# EAGLE design EnvFollower (EAGLE 7.7.0)
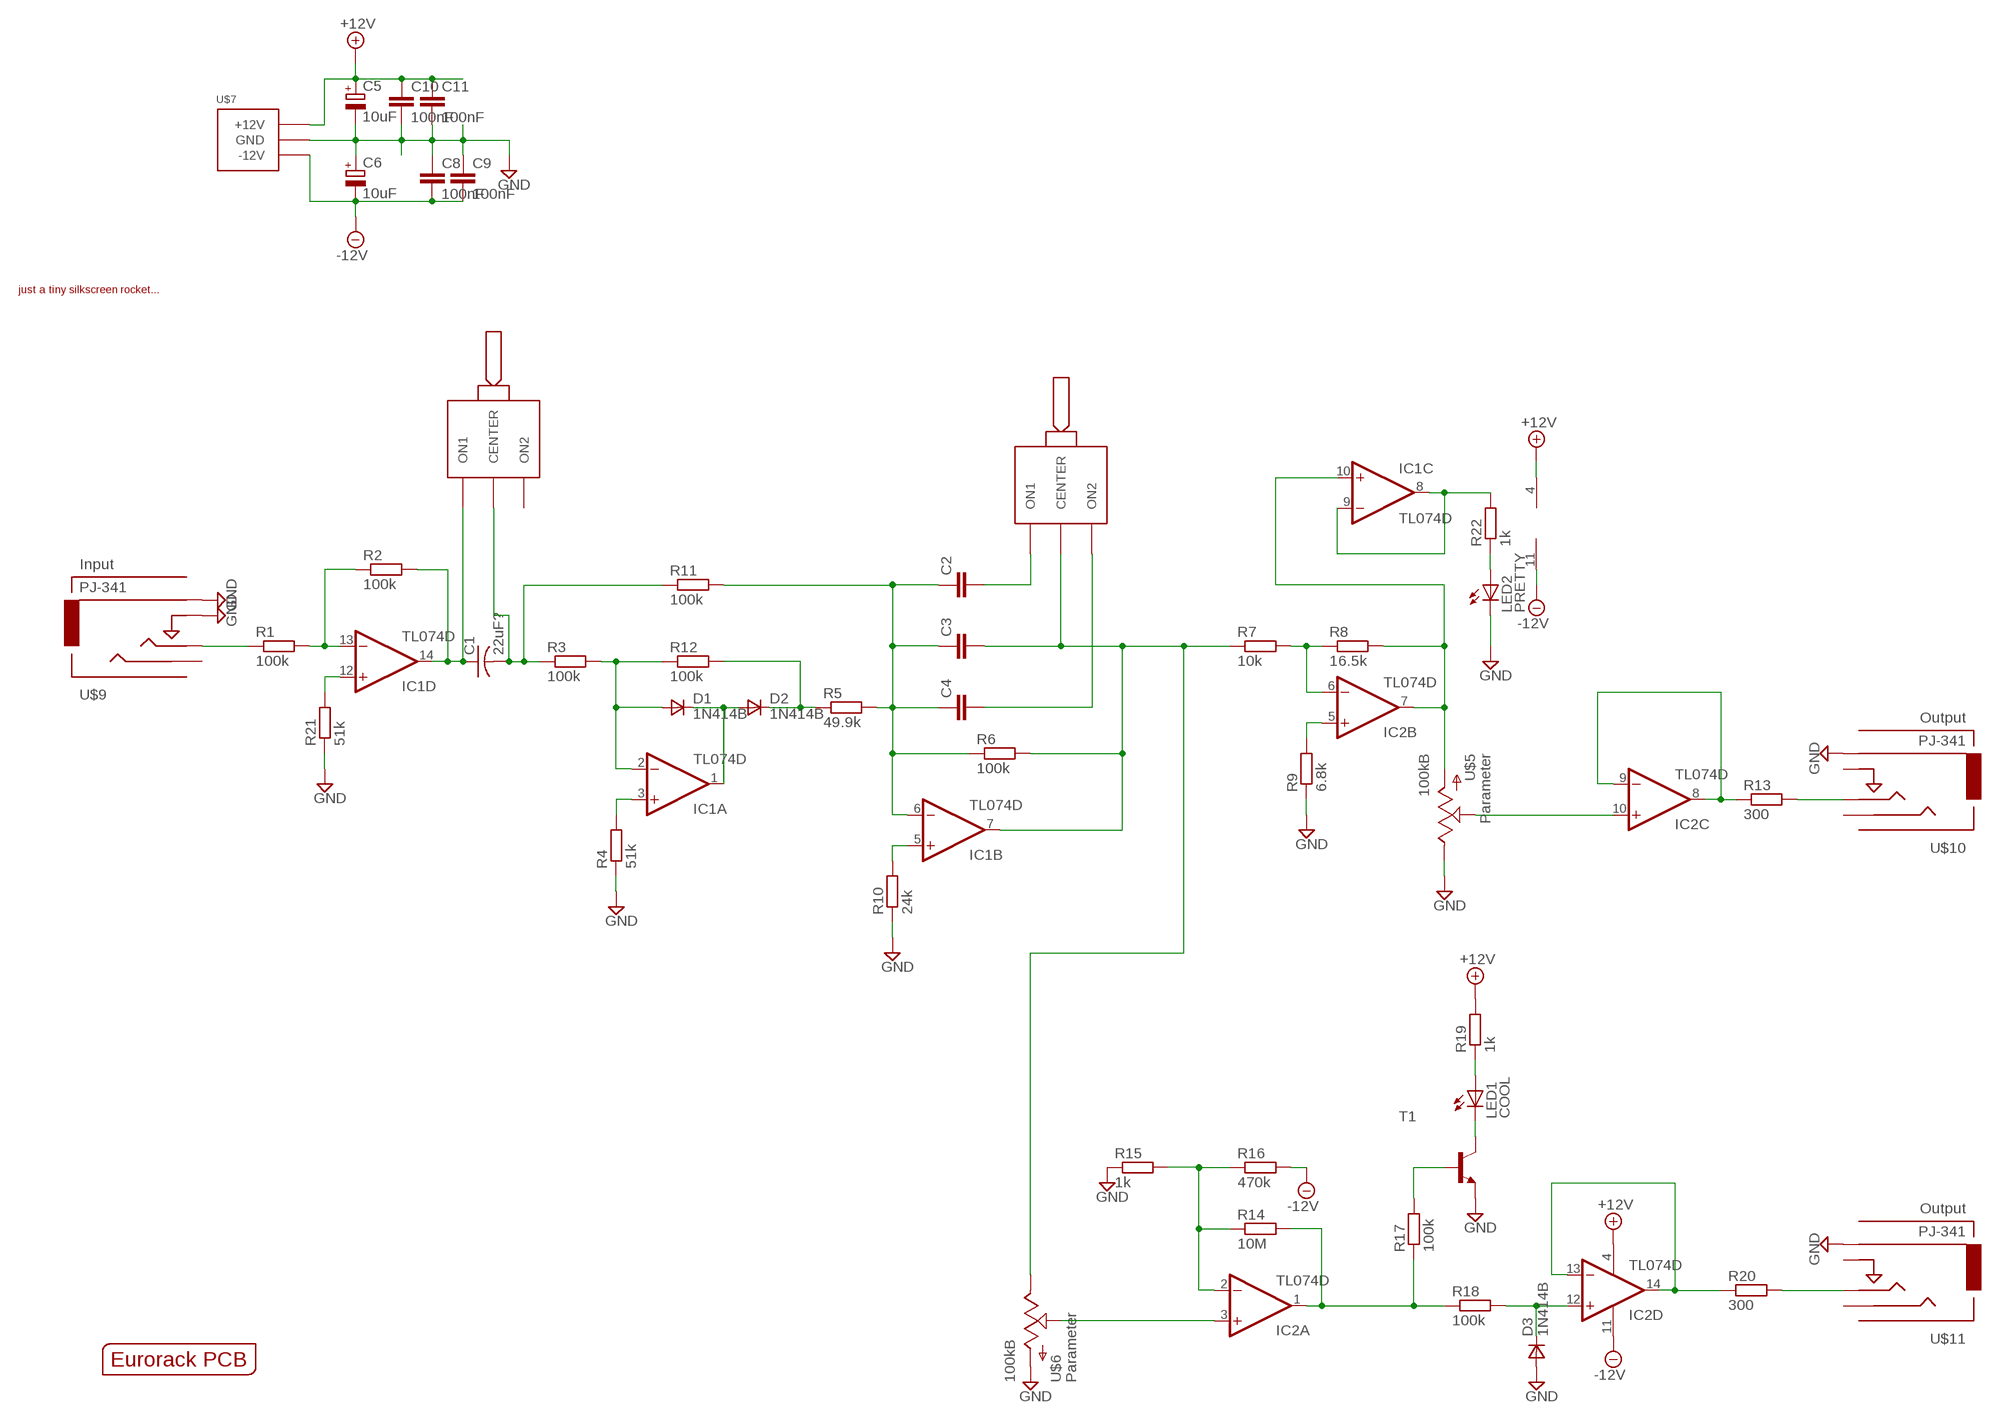
[diagram p0: schematic, sheet 1]

## Parts
C1  22uF?  C-USC1210K  [C1210K]
C2  C-EUC0603K  [C0603K]
C3  C-EUC0603K  [C0603K]
C4  C-EUC0603K  [C0603K]
C5  10uF  CPOL-EU153CLV-0505  [153CLV-0505]
C6  10uF  CPOL-EU153CLV-0505  [153CLV-0505]
C8  100nF  C-EUC0603K  [C0603K]
C9  100nF  C-EUC0603K  [C0603K]
C10  100nF  C-EUC0603K  [C0603K]
C11  100nF  C-EUC0603K  [C0603K]
D1  1N414B  DSOT23  [SOT-23]
D2  1N414B  DSOT23  [SOT-23]
D3  1N414B  DSOT23  [SOT-23]
IC1  TL074D  [SO14]
IC2  TL074D  [SO14]
LED1  COOL  LED3MM  [LED3MM]
LED2  PRETTY  LED3MM  [LED3MM]
R1  100k  R-EU_R0603  [R0603]
R2  100k  R-EU_R0603  [R0603]
R3  100k  R-EU_R0603  [R0603]
R4  51k  R-EU_R0603  [R0603]
R5  49.9k  R-EU_R0603  [R0603]
R6  100k  R-EU_R0603  [R0603]
R7  10k  R-EU_R0603  [R0603]
R8  16.5k  R-EU_R0603  [R0603]
R9  6.8k  R-EU_R0603  [R0603]
R10  24k  R-EU_R0603  [R0603]
R11  100k  R-EU_R0603  [R0603]
R12  100k  R-EU_R0603  [R0603]
R13  300  R-EU_R0603  [R0603]
R14  10M  R-EU_R0603  [R0603]
R15  1k  R-EU_R0603  [R0603]
R16  470k  R-EU_R0603  [R0603]
R17  100k  R-EU_R0603  [R0603]
R18  100k  R-EU_R0603  [R0603]
R19  1k  R-EU_R0603  [R0603]
R20  300  R-EU_R0603  [R0603]
R21  51k  R-EU_R0603  [R0603]
R22  1k  R-EU_R0603  [R0603]
T1  BCX70-NPN-SOT23-BEC  [SOT23-BEC]
U$1  EURORACK_PCB4HP  [EURORACK4HPPCB]
U$2  JUSTATINYROCKET  [JUSTATINYROCKET]
U$4  ONOFFON  [MULTICOMP1MS-ONOFFON]
U$5  100kB  POTZEPHPOT  [OG-POTS_ALPS_POT_VERTICAL]
U$6  100kB  POTZEPHPOT  [OG-POTS_ALPS_POT_VERTICAL]
U$7  POWER_SIMPLE10-OTHERSIDE  [POWER_10_LABELSOTHERSIDE]
U$8  ONOFFON  [MULTICOMP1MS-ONOFFON]
U$9  PJ-341  AUDIO-JACKINPUT  [3.5MM-JACK-SWITCH-13MM-INPUT]
U$10  PJ-341  AUDIO-JACKOUTPUT  [3.5MM-JACK-SWITCH-13MM-OUTPUT]
U$11  PJ-341  AUDIO-JACKOUTPUT  [3.5MM-JACK-SWITCH-13MM-OUTPUT]

## Nets
+12V [power]: C5.+ C10.1 C11.1 IC1.4(P:V+) IC2.4(P:V+) R19.2 U$7.9(+12V) U$7.10(+12V)
-12V [power]: C6.- C8.2 C9.2 IC1.11(P:V-) IC2.11(P:V-) R16.2 U$7.1(-12V) U$7.2(-12V)
GND [power]: C5.- C6.+ C8.1 C9.1 C10.2 C11.2 D3.3(A) LED2.K(C) R4.1 R9.1 R10.1 R15.1 R21.1 T1.E U$5.P$1(E) U$6.P$3(A) U$7.3(GND) U$7.4(GND) U$7.5(GND) U$7.6(GND) U$7.7(GND) U$7.8(GND) U$9.RING@3(RING) U$9.SWITCH@3(SWITCH) U$10.RING@3(RING) U$11.RING@3(RING)
N$1: IC1.8(C:OUT) IC1.9(C:-IN) R22.2
N$2: D2.1(C) R5.1 R12.2
N$3: C2.1 C3.1 C4.1 IC1.6(B:-IN) R5.2 R6.1 R11.2
N$4: R1.1 U$9.TIP@3(TIP)
N$5: IC1.13(D:-IN) R1.2 R2.1
N$6: C1.2 R3.1 R11.1 U$4.2(CENTER)
N$7: C1.1 IC1.14(D:OUT) R2.2 U$4.1(ON1)
N$8 [power]: LED2.A R22.1
N$9: D1.3(A) IC1.2(A:-IN) R3.2 R12.1
N$10: D1.1(C) D2.3(A) IC1.1(A:OUT)
N$11: IC1.3(A:+IN) R4.2
N$12: IC1.12(D:+IN) R21.2
N$15: C3.2 IC1.7(B:OUT) R6.2 R7.1 U$6.P$1(E) U$8.2(CENTER)
N$16: C2.2 U$8.1(ON1)
N$17: C4.2 U$8.3(ON2)
N$20: IC1.5(B:+IN) R10.2
N$22: IC2.6(B:-IN) R7.2 R8.1
N$23: IC2.5(B:+IN) R9.2
N$24: IC1.10(C:+IN) IC2.7(B:OUT) R8.2 U$5.P$3(A)
N$25: IC2.10(C:+IN) U$5.P$2(S)
N$26: IC2.8(C:OUT) IC2.9(C:-IN) R13.1
N$27: R13.2 U$10.TIP@3(TIP)
N$28: IC2.2(A:-IN) R14.1 R15.2 R16.1
N$29: IC2.1(A:OUT) R14.2 R17.1 R18.1
N$30: R17.2 T1.B
N$31: LED1.K(C) T1.C
N$32: LED1.A R19.1
N$33: D3.1(C) IC2.12(D:+IN) R18.2
N$34: IC2.13(D:-IN) IC2.14(D:OUT) R20.1
N$35: R20.2 U$11.TIP@3(TIP)
N$36: IC2.3(A:+IN) U$6.P$2(S)
Unconnected: U$4.3(ON2) U$9.SECOND@3(SECOND) U$10.SECOND@3(SECOND) U$10.SWITCH@3(SWITCH) U$11.SECOND@3(SECOND) U$11.SWITCH@3(SWITCH)

## Library data of the parts
C1 = adafruit:C-US: CAPACITOR, American symbol
C2-C4 C8-C11 = resistor:C-EU: CAPACITOR, European symbol
C5 C6 = resistor:CPOL-EU: POLARIZED CAPACITOR, European symbol
D1-D3 = zetex:D: DIODE; MPN: CDSOT23-T03; OC_FARNELL: 1824866; OC_NEWARK: 75K7096
IC1 IC2 = EurorackModularParts:TL074: OP AMP
LED1 LED2 = led:LED: LED OSRAM: - CHIPLED LG R971, LG N971, LY N971, LG Q971, LY Q971, LO R971, LY R971 LH N974, LH R974 LS Q976, LO Q976, LY Q976 LO Q996 - Hyper CHIPLED LW Q18S LB Q993, LB Q99A, LB R99A - SideLED LS A670, LO A670, LY A670, LG A670, LP A670 LB A673, LV A673, LT A673, LW A673 LH A674 LY A675 LS A676, LA A676, LO A676, LY A676, LW A676 LS A679, LY A679, LG A679 - Hyper Micro SIDELED® LS Y876, LA Y876, LO Y876, LY Y876 LT Y87S - SmartLED LW L88C, LW L88S LB L89C, LB L89S, LG L890 LS L89K, LO L89K, LY L89K LS L896, LA L896, LO L896, LY L896 - TOPLED LS T670, LO T670, LY T670, LG T670, LP T670 LSG T670, LSP T670, LSY T670, LOP T670, LYG T670 LG T671, LOG T671, LSG T671 LB T673, LV T673, LT T673, LW T673 LH T674 LS T676, LA T676, LO T676, LY T676, LB T676, LH T676, LSB T676, LW T676 LB T67C, LV T67C, LT T67C, LS T67K, LO T67K, LY T67K, LW E67C LS E67B, LA E67B, LO E67B, LY E67B, LB E67C, LV E67C, LT E67C LW T67C LS T679, LY T679, LG T679 LS T770, LO T770, LY T770, LG T770, LP T770 LB T773, LV T773, LT T773, LW T773 LH T774 LS E675, LA E675, LY E675, LS T675 LS T776, LA T776, LO T776, LY T776, LB T776 LHGB T686 LT T68C, LB T68C - Hyper Mini TOPLED® LB M676 - Mini TOPLED Santana® LG M470 LS M47K, LO M47K, LY M47K Source: http://www.osram.convergy.de LUXEON: - LUMILED® LXK2-PW12-R00, LXK2-PW12-S00, LXK2-PW14-U00, LXK2-PW14-V00 LXK2-PM12-R00, LXK2-PM12-S00, LXK2-PM14-U00 LXK2-PE12-Q00, LXK2-PE12-R00, LXK2-PE12-S00, LXK2-PE14-T00, LXK2-PE14-U00 LXK2-PB12-K00, LXK2-PB12-L00, LXK2-PB12-M00, LXK2-PB14-N00, LXK2-PB14-P00, LXK2-PB14-Q00 LXK2-PR12-L00, LXK2-PR12-M00, LXK2-PR14-Q00, LXK2-PR14-R00 LXK2-PD12-Q00, LXK2-PD12-R00, LXK2-PD12-S00 LXK2-PH12-R00, LXK2-PH12-S00 LXK2-PL12-P00, LXK2-PL12-Q00, LXK2-PL12-R00 Source: www.luxeon.com KINGBRIGHT: KA-3528ASYC Source: www.kingbright.com
R1-R22 = resistor:R-EU_: RESISTOR, European symbol
T1 = transistor:*-NPN-: NPN Transistror BF959 corrected 2008.03.06
U$1 = EurorackModularParts:EURORACK_PCB
U$2 = zephod-components:JUSTATINYROCKET
U$4 U$8 = EurorackModularParts:ONOFFON
U$5 U$6 = EurorackModularParts:POT; DESC: Parameter
U$7 = EurorackModularParts:POWER_SIMPLE
U$9 = EurorackModularParts:AUDIO-JACK: Switching Mono 3.5mm Audio Jack from Erthenvar.; DESC: Input; MPN: PJ-341
U$10 U$11 = EurorackModularParts:AUDIO-JACK: Switching Mono 3.5mm Audio Jack from Erthenvar.; DESC: Output; MPN: PJ-341

## Net classes
0 default: width 0.203 mm
1 power: width 0.381 mm

## Board
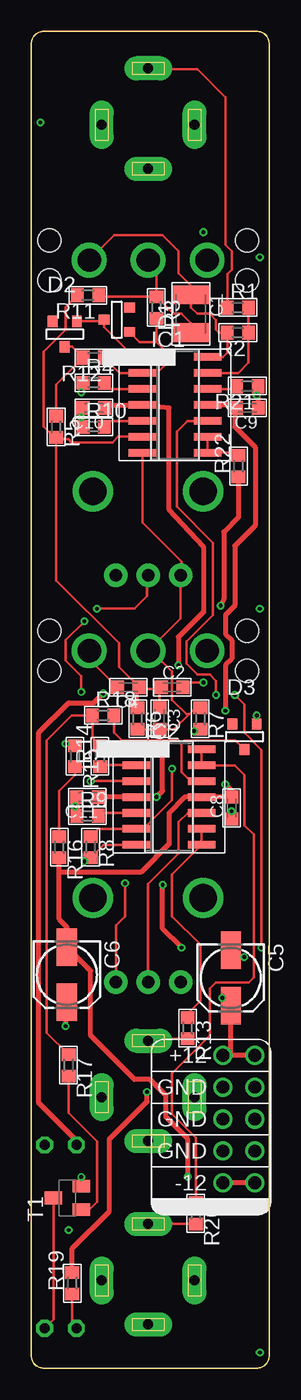
[diagram p1: board, top side]
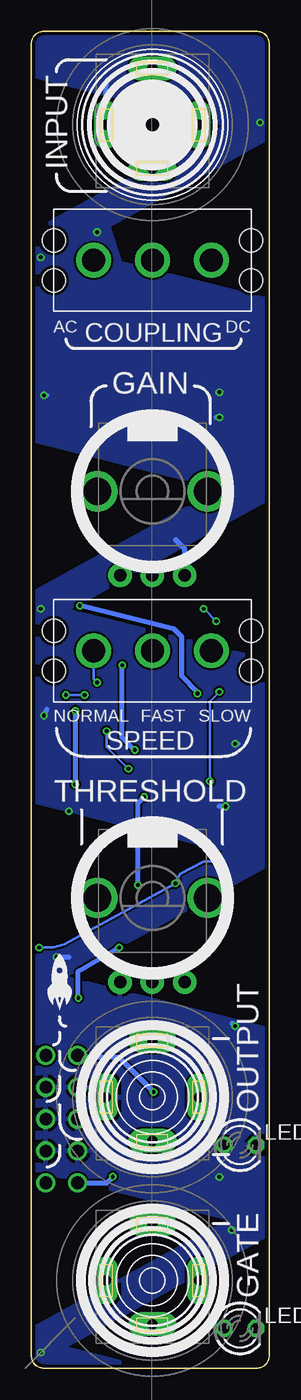
[diagram p2: board, bottom side, seen from below]

Size 18.98 x 106.5 mm. Coordinates in mm from the lower left corner, seen from the top.
Copper layers (1*16): Top 0.035mm / dielectric 1.5mm / Bottom 0.035mm
Design rules "ITEADstudio_DRC": minimum track width 6mil, minimum drill 12mil, track to track 6mil, track to pad 6mil, pad to pad 6mil, via to via 6mil, smd to smd 0mil, copper to edge 10mil, drill to drill 10mil, minimum pad ring 10mil, minimum via ring 6mil, stop-mask expansion 2mil, vias tented up to drill 100mil, thermal gap 10mil

### Footprints (pad centres in the part's own frame; a part is rotated, then mirrored left to right if it is on the bottom)
C1210K = smd 1.5 x 2.9: 1 -1.5,0; 2 1.5,0
C0603K = smd 1.05 x 1.08: 1 -0.875,0; 2 0.875,0
153CLV-0505 = smd 3 x 1.6: + 2.2,0; - -2.2,0
SOT-23 = smd 0.787 x 0.889: 1 0.025,-1.016; 2 -0.94,1.016; 3 0.991,1.016
SO14 = smd 0.6 x 2.2: 1 -3.81,-2.6; 2 -2.54,-2.6; 3 -1.27,-2.6; 4 0,-2.6; 5 1.27,-2.6; 6 2.54,-2.6; 7 3.81,-2.6; 8 3.81,2.6; 9 2.54,2.6; 10 1.27,2.6; 11 0,2.6; 12 -1.27,2.6; 13 -2.54,2.6; 14 -3.81,2.6
LED3MM = drill 0.813 octagon: A -1.27,0; K 1.27,0
R0603 = smd 1 x 1.1: 1 -0.85,0; 2 0.85,0
SOT23-BEC = smd 1 x 1.4: B -0.95,-1.1; C 0,1.1; E 0.95,-1.1
MULTICOMP1MS-ONOFFON = drill 1.85: 1 -4.7,0; 2 0,0; 3 4.7,0 | hole 1.85: -7.875,1.59; -7.875,-1.59; 7.875,1.59; 7.875,-1.59
OG-POTS_ALPS_POT_VERTICAL = drill 1 pad 1.88: P$1 -2.58,-6.7; P$2 0,-6.7; P$3 2.58,-6.7 | drill 2.2 pad 3.175: P$4 4.4,0; P$5 -4.4,0
POWER_10_LABELSOTHERSIDE = drill 1.016: 1 -5.08,-1.27; 2 -5.08,1.27; 3 -2.54,-1.27; 4 -2.54,1.27; 5 0,-1.27; 6 0,1.27; 7 2.54,-1.27; 8 2.54,1.27; 9 5.08,-1.27; 10 5.08,1.27
3.5MM-JACK-SWITCH-13MM-INPUT = drill 0.8 pad 1.93 long: RING@3 -3.7,0; SECOND@3 0,-3.5; SWITCH@3 3.7,0; TIP@3 0,4.5
3.5MM-JACK-SWITCH-13MM-OUTPUT = drill 0.8 pad 1.93 long: RING@3 -3.7,0; SECOND@3 0,-3.5; SWITCH@3 3.7,0; TIP@3 0,4.5

### Placement (x,y rotation side)
C1  12.73,84 270 top
C2  11.23,54.25 0 top
C3  10.23,51.75 270 top
C4  7.73,54.25 180 top
C5  15.91,31.09 270 top
C6  2.84,31.34 270 top
C8  15.98,44.62 90 top
C9  17.23,76.5 180 top
C10  4.98,76.5 180 top
C11  4.48,45.5 180 top
D1  6.82,83.55 270 top
D2  2.64,82.38 0 top
D3  16.98,50.3 0 top
IC1  11.46,76.74 270 top
IC2  10.98,45.5 270 top
LED1  2.34,3.17 0 bottom
LED2  2.34,17.78 0 bottom
R1  16.48,84.5 0 top
R2  16.48,82.5 180 top
R3  9.98,84.5 270 top
R4  4.98,78.5 0 top
R5  1.98,75 270 top
R6  8.48,51.75 270 top
R7  13.48,51.75 270 top
R8  4.73,41.5 270 top
R9  4.48,44 0 top
R10  4.98,75 0 top
R11  4.52,85.48 180 top
R12  4.98,80.5 180 top
R13  12.47,27.09 270 top
R14  5.48,48.75 90 top
R15  3.48,48.75 270 top
R16  2.23,41.5 270 top
R17  2.97,24.13 270 top
R18  5.73,52 0 top
R19  3.26,6.77 90 top
R20  13.12,12.34 270 top
R21  17.23,78.25 180 top
R22  16.52,71.87 90 top
T1  2.88,13.57 90 top
U$1  19.48,0 0 bottom
U$2  16.73,30.75 0 bottom
U$4  9.32,88.27 180 bottom
U$5  9.32,37.47 0 bottom
U$6  9.32,69.85 0 bottom
U$7  16.55,19.84 90 top
U$8  9.32,57.15 0 bottom
U$9  9.32,99.06 0 bottom
U$10  9.32,21.59 0 bottom
U$11  9.32,6.98 0 bottom

### Tracks (layer width: path | path; a pad name or v marks a point on that pad's centre or on a via)
+12V  (via drill 0.3)
  Top 0.381: U$7.9 U$7.10 15.91,24.92 C5.+ 15.84,28.89 v15.23,29.5 | C11.1 IC2.4 v9.98,45.5 10.48,46 10.48,49 v10.73,49.25 | C10.1 6.1,76.74 IC1.4 8.99,76.63 9.61,76.63 11,76.5 11,68.41 13.76,65.4 13.76,60.28 11.73,58.25 v11.73,56 | R19.2 3.26,9.53 6.23,12.5 6.23,18.25 9.23,21.25 v9.23,22 | v11.98,33.5 10.48,35 v10.48,38.5
  Bottom 0.381: v9.23,22 11.98,24.75 14.87,24.75 U$7.10 | v15.23,29.5 15.23,31.62 v11.98,33.5 | v10.48,38.5 10.48,45 v9.98,45.5 | v10.73,49.25 11.75,50.27 11.75,55.98 v11.73,56
-12V  (via drill 0.3)
  Top 0.381: U$7.1 U$7.2 | IC1.11 16.3,76.74 C9.2 16.23,76.38 16.23,75 17.86,73.38 17.86,67.12 16.23,65.5 16.23,60.75 15.48,60 15.48,58.5 15.98,58 15.98,56.5 15.48,56 v15.48,52.38 | 2.23,39.5 2.23,35.75 2.84,35.14 C6.- 4.73,31.65 4.73,26.5 8.23,23 9.48,23 10.73,21.75 10.73,20 12.48,18.25 v12.48,15.25 | 2.23,39.5 R16.2 | 2.23,39.5 8.73,39.5 10.98,41.75 10.98,44.25 12.23,45.5 IC2.11 C8.2 16.11,45.88 v15.48,46.5
  Bottom 0.381: U$7.2 12.97,14.76 v12.48,15.25 | v15.48,52.38 v15.48,46.5
GND  (via drill 0.3)
  Top 0.381: T1.E v3.97,15.23 v3.98,15.23 | C5.- 15.91,32.83 v16.98,32.75 | C6.+ 2.73,27.5 v2.73,27.25 | C8.1 v15.98,44.38 | D3.3 17.99,51.51 v17.98,52 | R15.1 v2.73,49.75 | C11.2 3.61,44.88 v3.48,44.75 3.63,44.6 R9.1 | R10.1 3.98,75.15 v3.98,75.75 3.98,76.38 C10.2 | R4.1 4.23,78.4 v3.98,77.75 | R21.1 18.08,77.6 v17.98,77.5 18.11,77.38 C9.1
  Bottom 0.381: v3.98,15.23 3.98,15.09 | v16.98,32.75 15.98,32.75 | v2.73,27.25 2.98,27.5 | v15.98,44.38 15.98,44.5 | v17.98,52 17.73,52.5 | v2.73,49.75 2.48,49.75 | v3.48,44.75 3.98,44.75 | v3.98,75.75 4.23,75.75 | v17.98,77.5 17.73,77.5 | U$6.P$3 6.74,65.26 7.48,66 | U$9.RING@3 13.02,102.21 12.98,102.25
  other vias: 18.23,1.25 2.98,11 18.23,60.5 18.23,88.5 0.73,99.25 13.73,90.5
  pour Bottom: -0.77,26.75 19.98,32 20.23,16.25 -0.52,11
  pour Bottom: -1.02,56 19.73,61.25 19.98,45.5 -0.77,40.25
  pour Bottom: -1.02,84.75 19.73,90 19.98,74.25 -0.77,69
  pour Bottom: -1.27,113.75 19.48,119 19.73,103.25 -1.02,98
  pour Bottom: -0.77,-2.75 19.98,2.5 20.23,-13.25 -0.52,-18.5
  pour Bottom: -0.52,13.75 19.98,2.5 19.98,-0.25 -0.52,11
  pour Bottom: -0.52,43.25 19.98,32 19.98,29.25 -0.52,40.5
  pour Bottom: -0.77,72.5 19.73,61.25 19.73,58.5 -0.77,69.75
  pour Bottom: -0.77,101.25 19.73,90 19.73,87.25 -0.77,98.5
  pour Bottom: 15.73,91 15.73,90.75 12.98,91.25 11.73,87.5 16.48,86.5 16.48,91
N$1
  Top 0.203: IC1.9 IC1.8 16.31,72.93 R22.2
N$2
  Top 0.203: R5.1 1.98,78.35 R12.2 3.27,81.36 D2.1
N$3
  Top 0.203: R5.2 1.83,74.15 0.98,75 0.98,81 2.73,82.75 2.73,84.54 R11.2 | IC1.6 6.93,74.2 6.48,73.75 3.23,73.75 2.98,74 2.13,74 R5.2 | C3.1 10.23,54.12 | 10.23,54.12 C2.1 | R6.1 8.48,54.12 C4.1 | 10.23,54.12 8.73,54.12 C4.1 | C4.1 6.98,55.88 6.98,57.75 1.98,62.75 R5.2
N$4
  Top 0.203: U$9.TIP@3 9.38,103.5 13.23,103.5 15.48,101.25 15.48,89.5 15.98,89 15.98,87.5 15.63,87.15 R1.1
N$5
  Top 0.203: IC1.13 16.51,79.28 17.33,80.1 R2.1 R1.2
N$6
  Top 0.203: 10.01,85.38 R3.1 | R3.1 5.5,85.35 R11.1 | R3.1 9.98,87.6 U$4.2 | C1.2 12.73,83.25 11.98,84 11.33,84 R3.1
N$7
  Top 0.203: U$4.1 6.61,90.25 10.48,90.25 11.73,89 11.73,87.25 12.73,86.25 C1.1 12.73,84.5 13.23,84 14.23,84 14.73,83.5 14.73,82.75 14.98,82.5 R2.2 15.63,80.9 15.28,80.55 IC1.14
N$8  (via drill 0.3)
  Top 0.381: R22.1 16.52,67.79 15.36,66.62 15.36,61.25 v15.11,60.75 | LED2.A 3.61,18.12 0.61,21.12 0.61,50.62 2.98,53 4.98,53 v5.73,53.75
  Bottom 0.381: v5.73,53.75 5.73,53.88 6.98,55.12 6.98,58.25 7.61,58.88 v15.11,60.75
N$9
  Top 0.203: R12.1 7.05,79.28 IC1.2 10.01,79.28 10.73,80 10.73,81 9.98,81.75 | 9.98,81.75 R3.2 | 9.98,81.75 8.64,81.75 D1.3
N$10
  Top 0.203: D2.3 5.67,83.4 D1.1 5.8,82.93 8.23,80.5 8.8,80.5 IC1.1
N$11
  Top 0.203: R4.2 6.32,78.01 IC1.3
N$12
  Top 0.203: R21.2 16.02,78.01 IC1.12
N$15
  Top 0.203: IC1.7 8.86,67.38 11.98,64.25 11.98,63.23 U$6.P$1 11.9,59.73 U$8.2 9.58,57.15 11.23,55.5 11.23,53.25 12.36,52.12 12.61,52.12 | R7.1 13.08,52.6 12.61,52.12 | 12.61,52.12 11.36,50.88 C3.2 8.51,50.88 R6.2
N$16  (via drill 0.3)
  Top 0.203: v13.73,54.62 12.48,54.62 C2.2
  Bottom 0.203: U$8.1 14.02,54.91 v13.73,54.62
N$17
  Top 0.203: C4.2 4.62,56.48 U$8.3
N$20
  Top 0.203: IC1.5 6.3,75.47 R10.2
N$22  (via drill 0.3)
  Top 0.203: R8.1 5.34,42.96 IC2.6 8.46,43.03 8.99,43.03 11.23,45.27 v11.23,47.75 | R7.2 13.33,50.75 v12.98,50.75
  Bottom 0.203: v11.23,47.75 12.98,49.5 v12.98,50.75
N$23
  Top 0.203: IC2.5 5.56,44.23 R9.2
N$24  (via drill 0.3)
  Top 0.203: IC2.7 5.77,41.69 R8.2 v4.23,40.38 | U$5.P$3 6.74,35.26 7.48,36 v7.48,38.62 | IC1.10 12.45,75.47 11.61,74.62 11.61,68.62 14.48,65.75 14.48,60 12.36,57.88 12.36,56.12 13.23,55.25 14.23,55.25 14.73,54.75 v14.73,53.62 | v18.36,33.5 18.36,49.25 16.98,50.62 16.98,52.88 v16.23,53.62
  Bottom 0.203: v18.36,33.5 17.23,33.5 16.36,33.75 v7.48,38.62 7.11,39.38 5.23,40.38 v4.23,40.38 | v16.23,53.62 v14.73,53.62
N$25
  Top 0.203: U$5.P$2 9.32,38.59 11.73,41 11.73,43.5 12.48,44.25 13.56,44.25 IC2.10
N$26
  Top 0.203: R13.1 12.47,28.24 13.48,29.25 13.48,33.75 11.23,36 11.23,39.34 IC2.8 IC2.9
N$27
  Top 0.203: R13.2 9.47,26.24 U$10.TIP@3
N$28
  Top 0.203: IC2.2 5.62,48.04 R14.1 R15.2 3.48,47.25 2.23,46 R16.1
N$29
  Top 0.203: IC2.1 5.77,49.31 R14.2 4.88,50.2 R18.1 3.23,52 1.23,50 1.23,26.72 R17.1
N$30
  Top 0.203: T1.B 4.62,12.62 5.23,13.23 5.23,18.06 2.97,20.32 R17.2
N$31
  Top 0.203: T1.C 1.78,3.88 LED1.K
N$32
  Top 0.203: R19.1 3.26,3.52 LED1.A
N$33
  Top 0.203: IC2.12 12.71,46.77 11.98,47.5 11.98,49.75 | 11.98,49.75 12.23,50 16.29,50 D3.1 | 11.98,49.75 11.73,50 7.23,50 6.58,50.65 R18.2
N$34
  Top 0.203: R20.1 13.12,18.36 11.23,20.25 11.23,23.5 14.23,26.5 14.23,30.25 14.73,30.75 17.36,30.75 17.73,31.12 17.73,42.5 16.98,43.25 16.98,47.25 16.23,48 13.62,48 IC2.13 IC2.14
N$35
  Top 0.203: R20.2 U$11.TIP@3
N$36  (via drill 0.3)
  Top 0.203: IC2.3 4.75,46.77 v4.73,46.75 | v3.98,53.88 3.98,55.12 2.73,56.38 2.73,58 v4.23,59.5 | v5.23,60.5 8.23,60.5 9.23,61.5 9.23,63.06 U$6.P$2
  Bottom 0.203: v4.73,46.75 4.73,53.12 v3.98,53.88 | v4.23,59.5 v5.23,60.5

### Text on the board
bPlace: INPUT | DC | AC | COUPLING | GAIN | SLOW | FAST | NORMAL | SPEED | THRESHOLD | OUTPUT | GATE